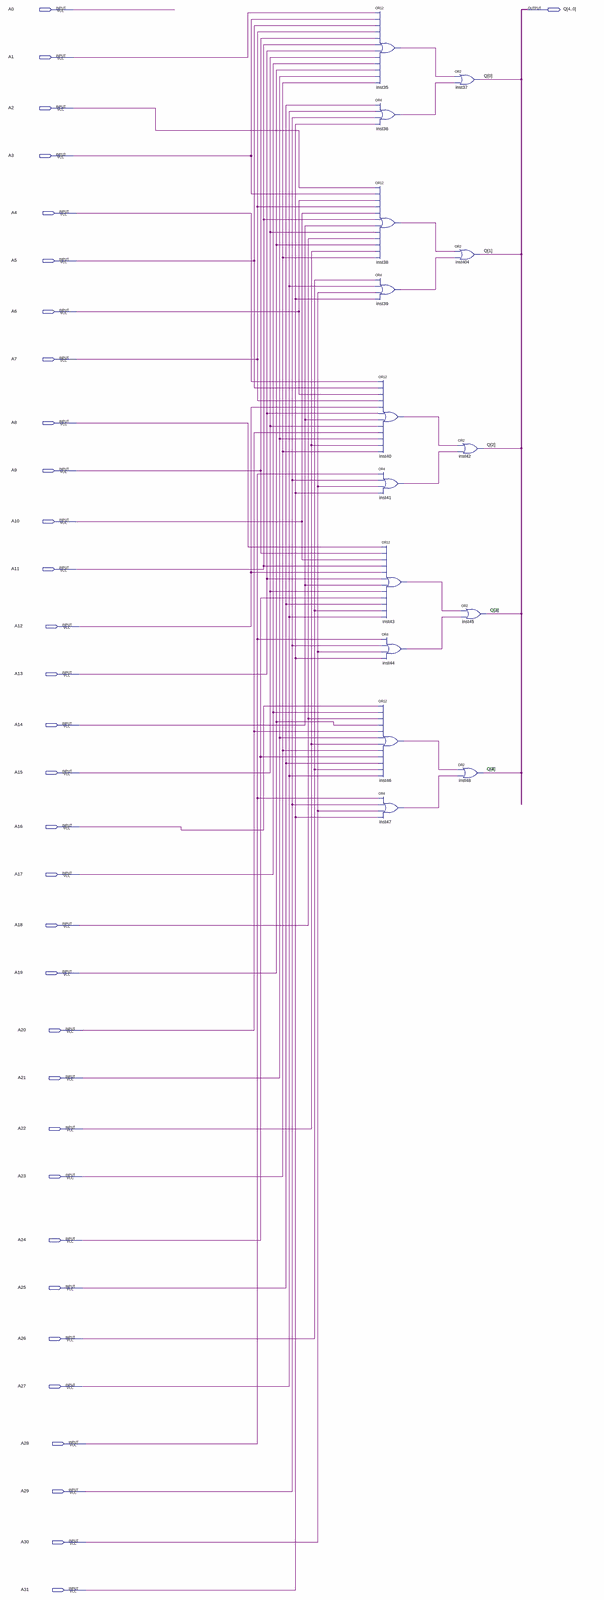
[diagram p0: schematic sheet, whole]
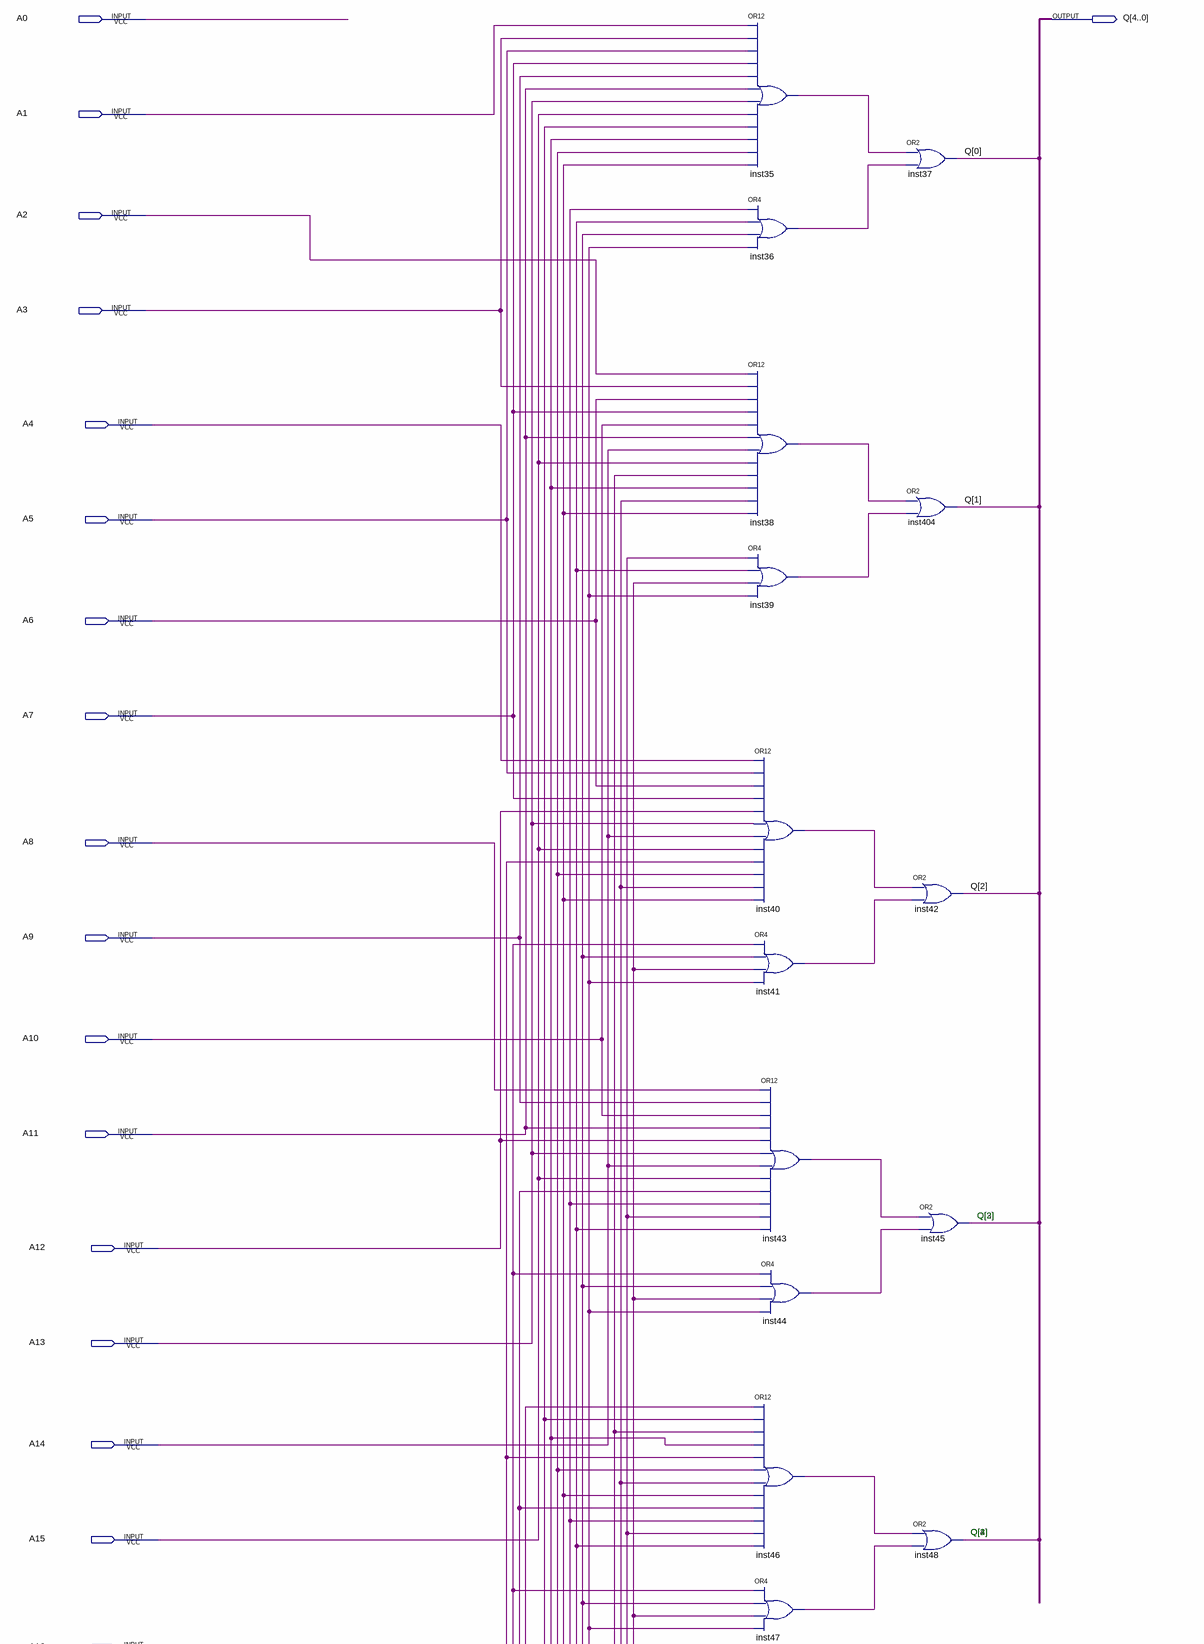
[diagram p1: schematic sheet, upper part]
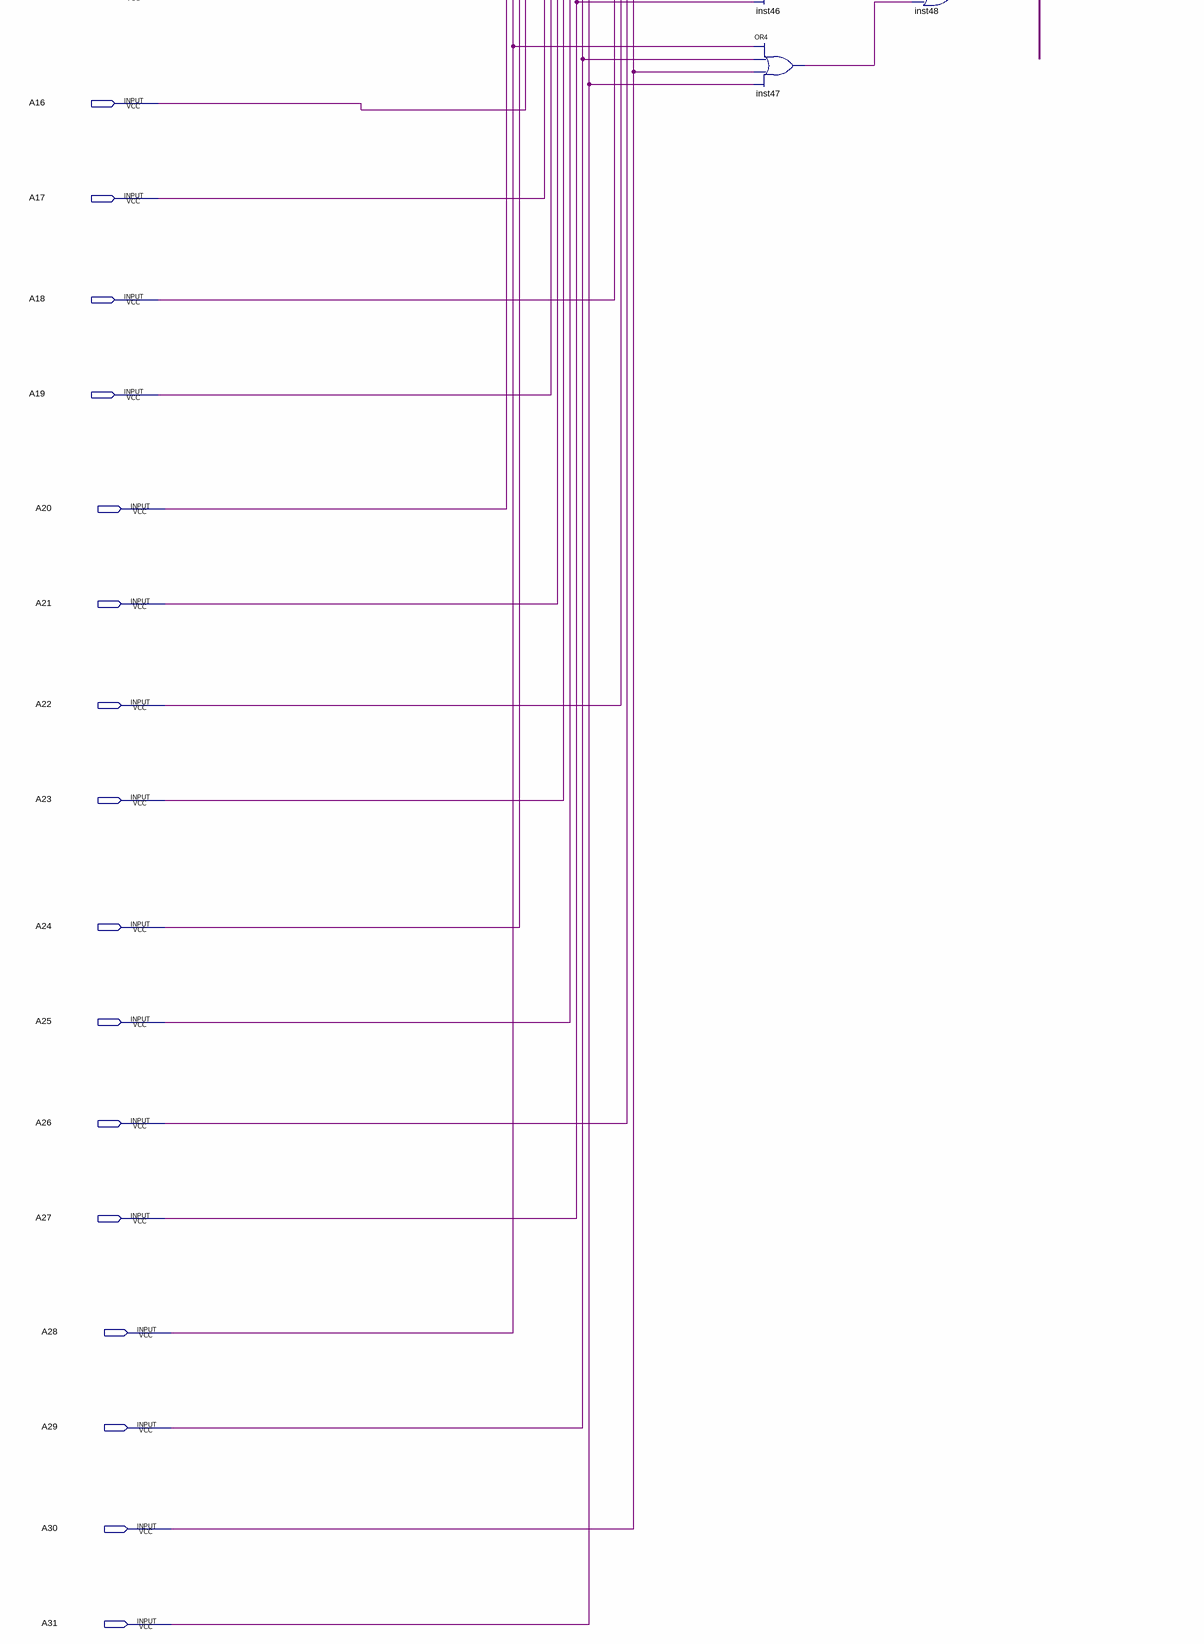
[diagram p2: schematic sheet, lower part]
// Quartus schematic Encoder_32.bdf as structural Verilog: 15 symbols, 33 pins
module Encoder_32 (
  input  A0,
  input  A1,
  input  A2,
  input  A3,
  input  A4,
  input  A5,
  input  A6,
  input  A7,
  input  A8,
  input  A9,
  input  A10,
  input  A11,
  input  A12,
  input  A13,
  input  A14,
  input  A15,
  input  A16,
  input  A17,
  input  A18,
  input  A19,
  input  A20,
  input  A21,
  input  A22,
  input  A23,
  input  A24,
  input  A25,
  input  A26,
  input  A27,
  input  A28,
  input  A29,
  input  A30,
  input  A31,
  output [4:0] Q
);

  wire inst35_out, inst36_out, inst38_out, inst39_out, inst40_out, inst41_out, inst43_out, inst44_out,
       inst46_out, inst47_out;

  or inst35 (inst35_out, A1, A3, A5, A7, A9, A11, A13, A15, A17, A19, A21, A23);
  or inst36 (inst36_out, A25, A27, A29, A31);
  or inst38 (inst38_out, A2, A3, A6, A7, A10, A11, A14, A15, A18, A19, A22, A23);
  or inst39 (inst39_out, A26, A27, A30, A31);
  or inst40 (inst40_out, A4, A5, A6, A7, A12, A13, A14, A15, A20, A21, A22, A23);
  or inst41 (inst41_out, A28, A29, A30, A31);
  or inst43 (inst43_out, A8, A9, A10, A11, A12, A13, A14, A15, A24, A25, A26, A27);
  or inst44 (inst44_out, A28, A29, A30, A31);
  or inst46 (inst46_out, A16, A17, A18, A19, A20, A21, A22, A23, A24, A25, A26, A27);
  or inst47 (inst47_out, A28, A29, A30, A31);
  or inst37 (Q[0], inst35_out, inst36_out);
  or inst404 (Q[1], inst38_out, inst39_out);
  or inst42 (Q[2], inst40_out, inst41_out);
  or inst45 (Q[3], inst43_out, inst44_out);
  or inst48 (Q[4], inst46_out, inst47_out);

  // Notes on the sheet:
  //   Q[2]
  //   Q[2]
  //   Q[3]
endmodule
